# EasyEDA schematic 1-Schematic_motor starter pcb design.json
TITLE: Sheet_1; REV: 1.0; Date: 2023-05-24; Sheet: 1/1; Drawn By: Ron Francis; Company: Your Company
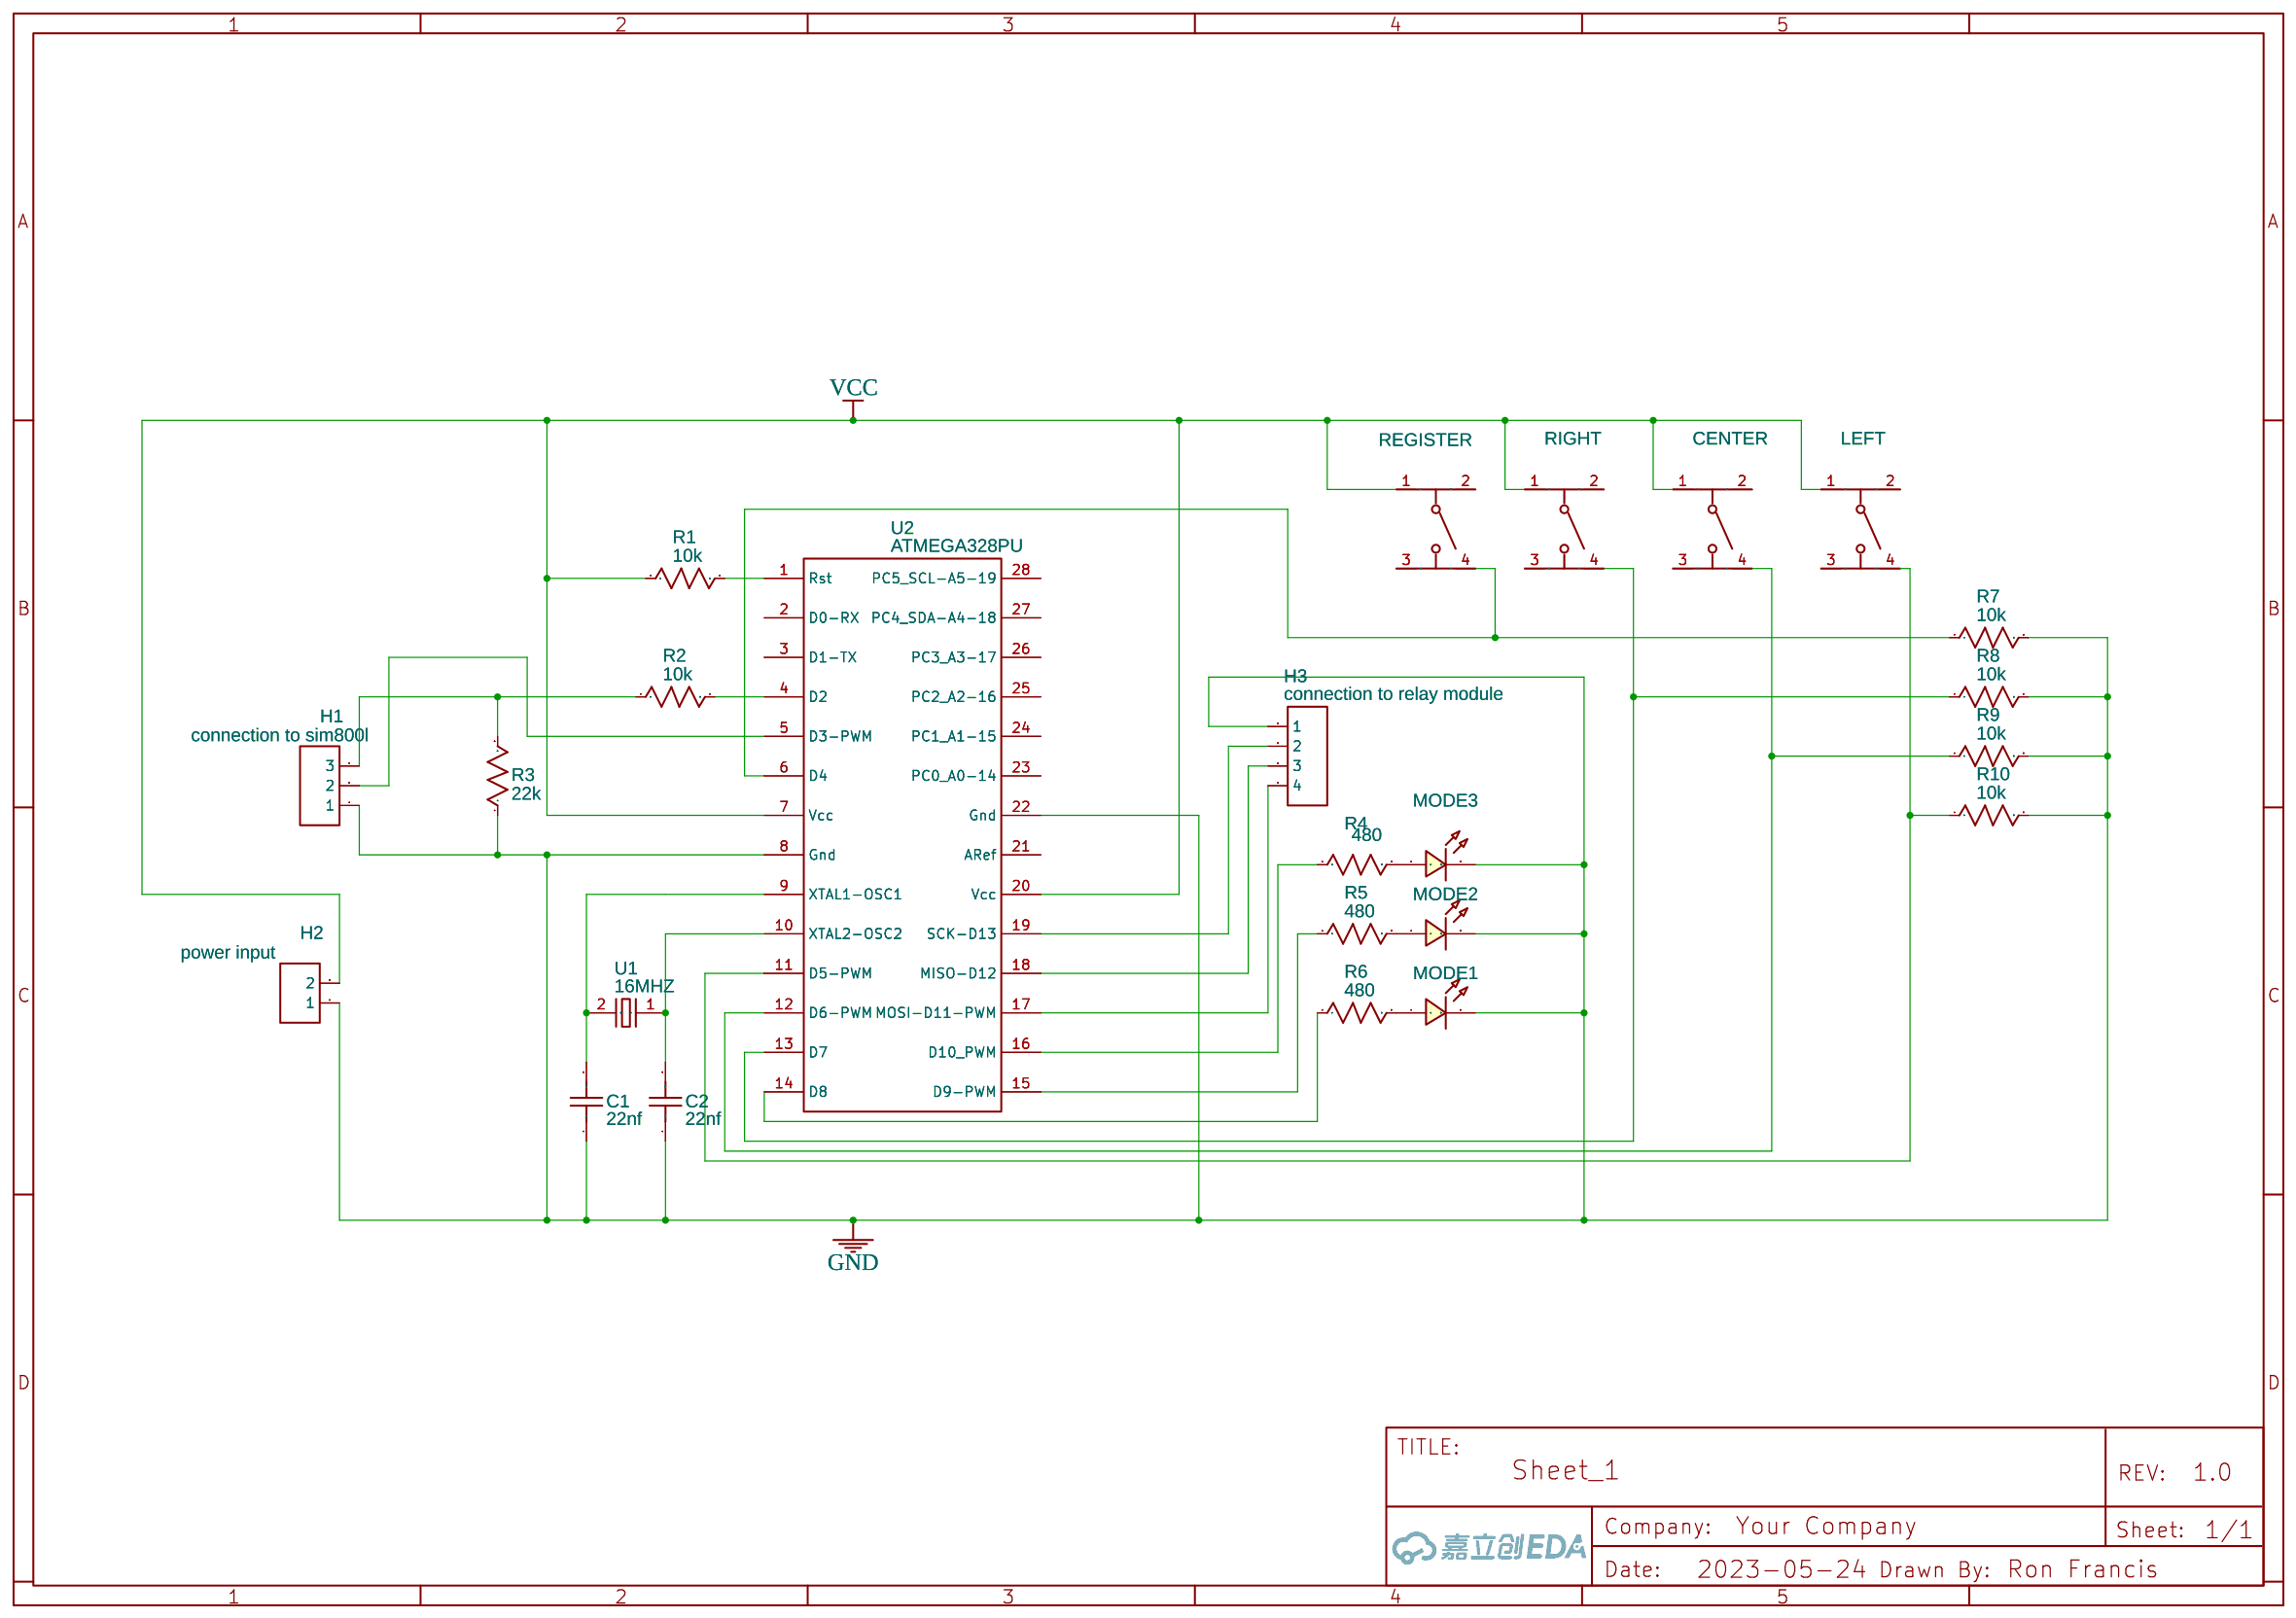
[diagram p0: schematic sheet]

## Parts
C1  22nf  [RAD-0.1]
C2  22nf  [RAD-0.1]
CENTER  Button-SMD-6×6×5mm  [SW-SMD_4P-L6.0-W6.0-P4.50-LS8.2]
H1  connection to sim800l  [HDR-F-2.54_1X3]
H2  power input  [HDR-F-2.54_1X2]
H3  connection to relay module  [HDR-F-2.54_1X4]
LEFT  Button-SMD-6×6×5mm  [SW-SMD_4P-L6.0-W6.0-P4.50-LS8.2]
MODE1  LED-TH-5mm_R  [LED-TH_BD5.0_RED]
MODE2  LED-TH-5mm_R  [LED-TH_BD5.0_RED]
MODE3  LED-TH-5mm_R  [LED-TH_BD5.0_RED]
R1  10k  [R_AXIAL-0.4]
R2  10k  [R_AXIAL-0.4]
R3  22k  [R_AXIAL-0.4]
R4  480  [R_AXIAL-0.4]
R5  480  [R_AXIAL-0.4]
R6  480  [R_AXIAL-0.4]
R7  10k  [R_AXIAL-0.4]
R8  10k  [R_AXIAL-0.4]
R9  10k  [R_AXIAL-0.4]
R10  10k  [R_AXIAL-0.4]
REGISTER  Button-SMD-6×6×5mm  [SW-SMD_4P-L6.0-W6.0-P4.50-LS8.2]
RIGHT  Button-SMD-6×6×5mm  [SW-SMD_4P-L6.0-W6.0-P4.50-LS8.2]
U1  16MHZ  [HC-49US_L11.0-W4.6-P4.88]
U2  ATMEGA328PU  [ATMEGA328PU]

## Library data of the parts
C1 C2 = C_RAD-0.1_US: Contributor: LCEDA_Lib
CENTER LEFT REGISTER RIGHT = Button-SMD-6×6×5mm: Supplier: LCSC; Manufacturer: ReliaPro; Manufacturer Part: 6×6×5mm RHOS; Supplier Part: C21456; JLCPCB Part Class: Extended Part
H1 = HDR-F-2.54_1x3: Supplier Part: C146690; Supplier: LCSC; Contributor: LCEDA_Lib
H2 = HDR-F-2.54_1x2: Supplier Part: C49661; Supplier: LCSC; Contributor: LCEDA_Lib
H3 = HDR-F-2.54_1x4: Supplier Part: C225501; Supplier: LCSC; Contributor: LCEDA_Lib
MODE1-MODE3 = LED-TH-5mm_R: Manufacturer: EVERLIGHT(台湾亿光); Manufacturer Part: 333-2SURD/S530-A3; Supplier Part: C87271; Supplier: LCSC; Contributor: LCEDA_Lib
R1-R10 = R_AXIAL-0.4_US: Contributor: LCEDA_Lib
U1 = 16MHZ_C9900024699: Supplier: LCSC; Supplier Part: C9900024699; Manufacturer: null; link: https://atta.szlcsc.comnull; JLCPCB Part Class: Extended Part; Contributor: lcsc
U2 = ATMEGA328PU: Contributor: gmorson

## Nets
GND: C1.1 C2.1 H1.1 H2.1 H3.1 MODE1.2 MODE2.2 MODE3.2 R3.1 R7.2 R8.2 R9.2 R10.2 U2.8(Gnd) U2.22(Gnd)
VCC: CENTER.1 H2.2 LEFT.1 R1.1 REGISTER.1 RIGHT.1 U2.7(Vcc) U2.20(Vcc)
Net-(C1-2): C1.2 U1.2 U2.9(XTAL1-OSC1)
Net-(C2-2): C2.2 U1.1 U2.10(XTAL2-OSC2)
Net-(CENTER-4): CENTER.4 R9.1 U2.12(D6-PWM)
Net-(H1-2): H1.2 U2.5(D3-PWM)
Net-(H1-3): H1.3 R2.1 R3.2
Net-(H3-2): H3.2 U2.19(SCK-D13)
Net-(H3-3): H3.3 U2.18(MISO-D12)
Net-(H3-4): H3.4 U2.17(MOSI-D11-PWM)
Net-(LEFT-4): LEFT.4 R10.1 U2.11(D5-PWM)
Net-(MODE1-1): MODE1.1 R6.2
Net-(MODE2-1): MODE2.1 R5.2
Net-(MODE3-1): MODE3.1 R4.2
Net-(R1-2): R1.2 U2.1(Rst)
Net-(R2-2): R2.2 U2.4(D2)
Net-(R4-1): R4.1 U2.16(D10 PWM)
Net-(R5-1): R5.1 U2.15(D9-PWM)
Net-(R6-1): R6.1 U2.14(D8)
Net-(R7-1): R7.1 REGISTER.4 U2.6(D4)
Net-(R8-1): R8.1 RIGHT.4 U2.13(D7)

Not connected (* = marked no-connect by the designer): CENTER 2 3; LEFT 2 3; REGISTER 2 3; RIGHT 2 3; U2 2(D0-RX) 3(D1-TX) 21(ARef) 23(PC0 A0-14) 24(PC1 A1-15) 25(PC2 A2-16) 26(PC3 A3-17) 27(PC4 SDA-A4-18) 28(PC5 SCL-A5-19)
